# EAGLE design coin12mm (EAGLE 6.4)
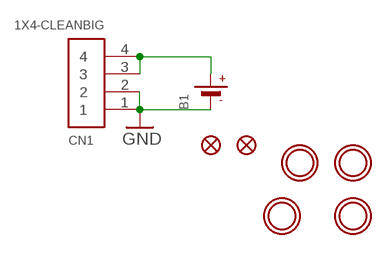
[diagram p0: schematic, sheet 1]

## Parts
B1  BATTERYCR1220_SMT  [CR1220]
CN1  1X4-CLEANBIG  [1X04-CLEANBIG]
FID1  FIDUCIAL""  [FIDUCIAL_1MM]
FID2  FIDUCIAL""  [FIDUCIAL_1MM]
U$1  MOUNTINGHOLE2.5  [MOUNTINGHOLE_2.5_PLATED]
U$2  MOUNTINGHOLE2.5  [MOUNTINGHOLE_2.5_PLATED]
U$3  MOUNTINGHOLE2.5  [MOUNTINGHOLE_2.5_PLATED]
U$5  MOUNTINGHOLE2.5  [MOUNTINGHOLE_2.5_PLATED]

## Nets
GND: B1.- CN1.1 CN1.2
N$1: B1.+$1(+) CN1.3 CN1.4

## Library data of the parts
B1 = microbuilder:BATTERY: CR1220 SMT - Digikey: 3001K-ND CD2032 BAT-HLD-001 - Digikey: BAT-HLD-001-ND
CN1 = adafruit2:1X4: 4-pin connector
FID1 FID2 = microbuilder:FIDUCIAL: Fiducial Alignment Points Various fiducial points for machine vision alignment.; BOM: EXCLUDE
U$1-U$3 U$5 = microbuilder:MOUNTINGHOLE: Mounting Hole For #2 screws (0.086"/2.18mm width, 0.094"/2.4mm hole) use 2.5mm; BOM: EXCLUDE

## Board
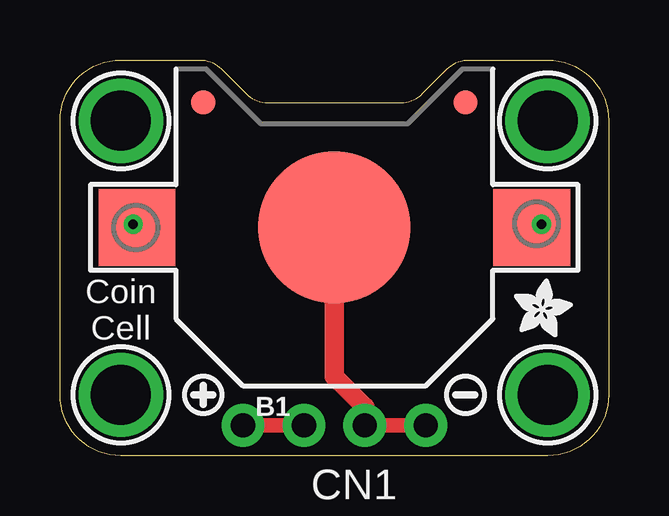
[diagram p1: board, top side]
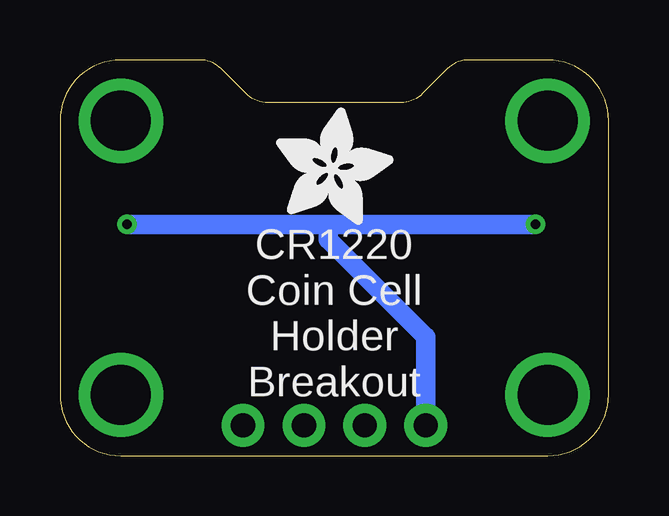
[diagram p2: board, bottom side, seen from below]

Size 22.86 x 16.51 mm. Coordinates in mm from the lower left corner, seen from the top.
Outline: 2.54,16.51 5.82,16.51 arc-45 6.72,16.14 7.76,15.1 arc45 8.65,14.73 14.21,14.73 arc45 15.1,15.1 16.14,16.14 arc-45 17.04,16.51 20.32,16.51 arc-90 22.86,13.97 22.86,2.54 arc-90 20.32,0 2.54,0 arc-90 0,2.54 0,13.97 arc-90 2.54,16.51
Copper layers (1*16): Top 0.035mm / dielectric 1.5mm / Bottom 0.035mm
Design rules "adafruit": minimum track width 8mil, minimum drill 15.5mil, track to track 8mil, track to pad 8mil, pad to pad 8mil, via to via 8mil, smd to smd 8mil, copper to edge 10mil, drill to drill 8mil, minimum pad ring 10mil, minimum via ring 8mil, stop-mask expansion 2mil, vias tented up to drill 20mil, thermal gap 10mil

### Footprints (pad centres in the part's own frame; a part is rotated, then mirrored left to right if it is on the bottom)
CR1220 = smd 3.2 x 3.2: +$1 -8.225,0; +$2 8.225,0 | smd 6.35 x 6.35: - 0,0
1X04-CLEANBIG = drill 1.016 pad 1.778: 1 -3.81,0; 2 -1.27,0; 3 1.27,0; 4 3.81,0
FIDUCIAL_1MM = smd 1 x 1: 1 0,0
MOUNTINGHOLE_2.5_PLATED = drill 2.5 pad 3.2: P$1 0,0

### Placement (x,y rotation side)
B1  11.43,9.53 0 top
CN1  11.43,1.27 180 top
FID1  5.97,14.73 0 top
FID2  16.89,14.73 0 top
U$1  2.54,13.97 0 top
U$2  20.32,13.97 0 top
U$3  2.54,2.54 0 top
U$4  [ADAFRUIT_5MM]  13.84,9.65 0 bottom
U$5  20.32,2.54 0 top
U$6  [SYMBOL_PLUS]  5.97,2.54 0 top
U$7  [SYMBOL_MINUS]  16.89,2.54 0 top
U$8  [ADAFRUIT_2.5MM]  18.92,4.95 0 top

### Tracks (layer width: path | path; a pad name or v marks a point on that pad's centre or on a via)
GND
  Top 0.61: CN1.2 CN1.1
  Top 0.813: B1.- 11.43,3.3 12.7,2.03 CN1.2
N$1  (via drill 0.39)
  Top 0.61: CN1.4 CN1.3
  Top 0.813: 3.17,9.4 3.21,9.43 B1.+$1 3.08,9.65 v3.05,9.65 | 19.81,9.65 v20.07,9.65
  Bottom 0.813: CN1.4 7.62,4.95 11.68,9.02 11.68,9.65 | v20.07,9.65 11.68,9.65 | 11.68,9.65 v3.05,9.65

### Text on the board
tPlace: Coin / Cell
bPlace: CR1220 / Coin Cell / Holder / Breakout